# EasyEDA schematic Sketch.json
TITLE: PCB1; REV: 1.0; Date: 2024-06-23; Sheet: 1/1; Drawn By: techyporcupine; Company: techyporcupine
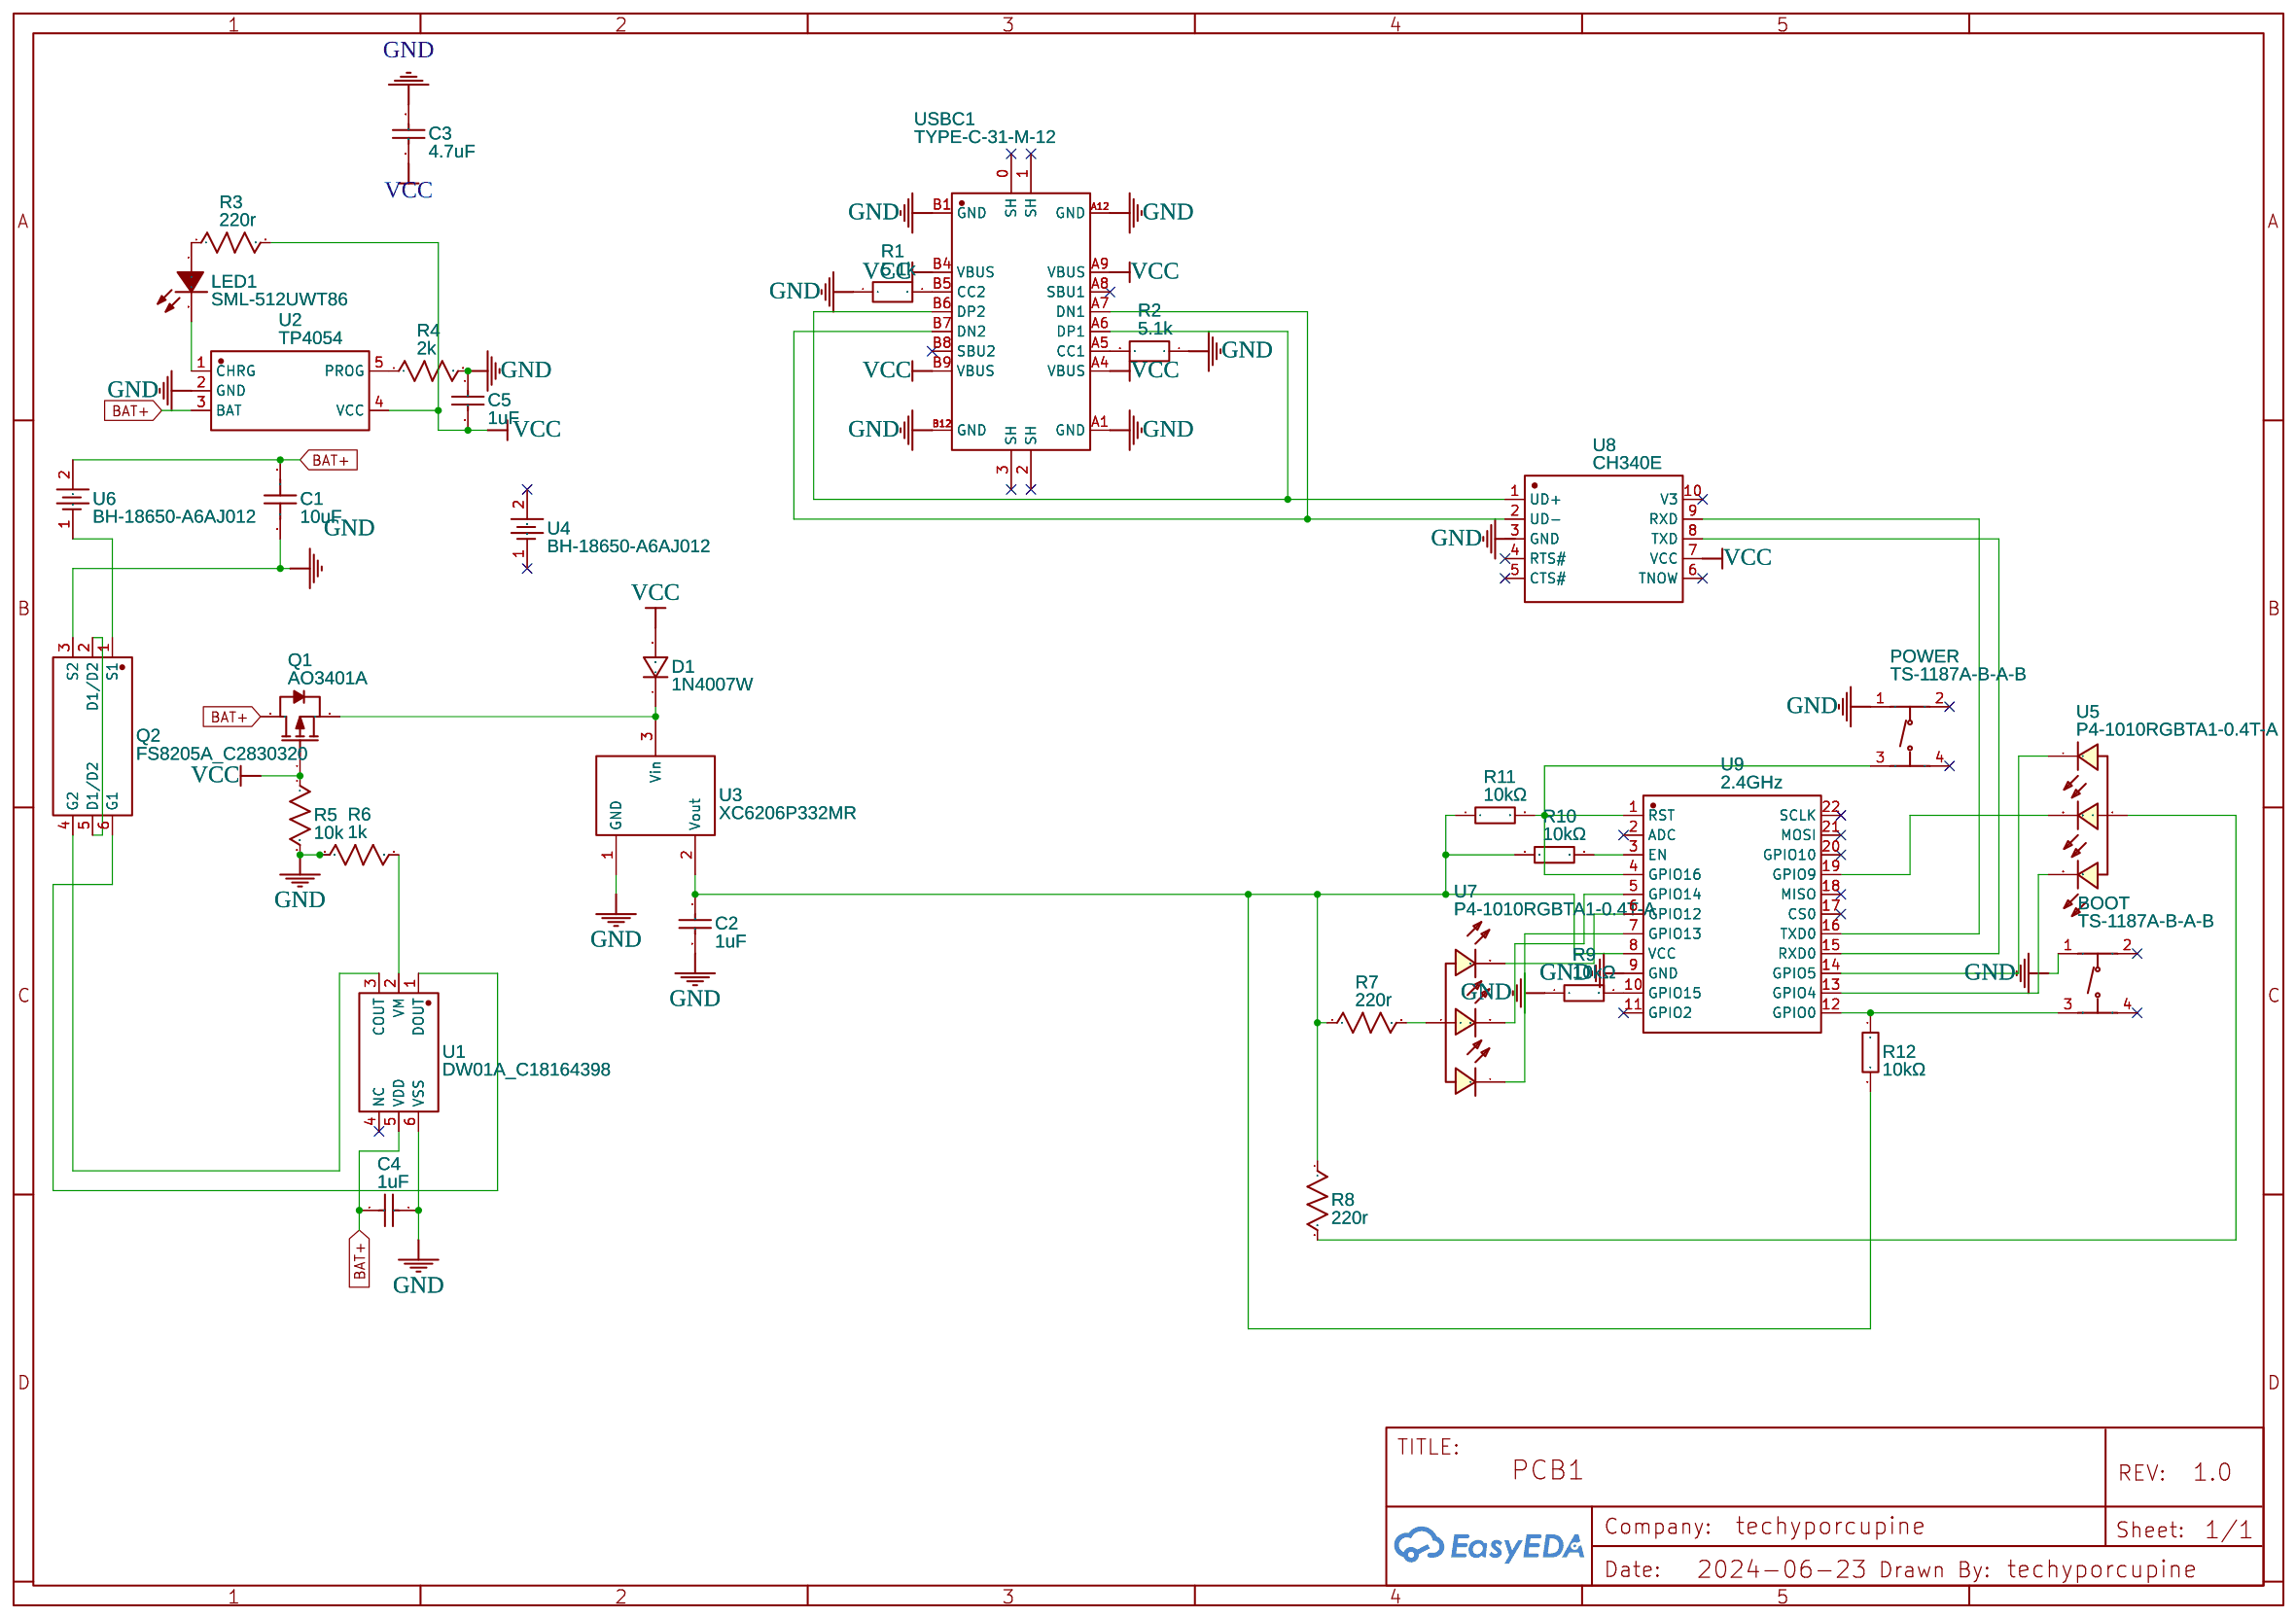
[diagram p0: schematic sheet]

## Parts
BOOT  TS-1187A-B-A-B  [SW-SMD_4P-L5.1-W5.1-P3.70-LS6.5-TL-2]
C1  10uF  [C0805]
C2  1uF  [C0805]
C3  4.7uF  [C0805]
C4  1uF  [C0805]
C5  1uF  [C0805]
D1  1N4007W  [SOD-123_L2.8-W1.8-LS3.7-RD]
LED1  SML-512UWT86  [LED0603-R-RD_RED]
POWER  TS-1187A-B-A-B  [SW-SMD_4P-L5.1-W5.1-P3.70-LS6.5-TL-2]
Q1  AO3401A  [SOT-23_L2.9-W1.3-P1.90-LS2.4-BR]
Q2  FS8205A_C2830320  [SOT-23-6_L2.9-W1.6-P0.95-LS2.8-BR]
R1  5.1k  [R0402]
R2  5.1k  [R0402]
R3  220r  [R0603]
R4  2k  [R0402]
R5  10k  [R0402]
R6  1k  [R0603]
R7  220r  [R0603]
R8  220r  [R0603]
R9  10kΩ  [R0603]
R10  10kΩ  [R0603]
R11  10kΩ  [R0603]
R12  10kΩ  [R0603]
U1  DW01A_C18164398  [SOT-23-6_L2.9-W1.6-P0.95-LS2.8-BR]
U2  TP4054  [SOT-23-5_L3.0-W1.7-P0.95-LS2.8-BL]
U3  XC6206P332MR  [SOT-23-3_L2.9-W1.6-P1.90-LS2.8-BR]
U4  BH-18650-A6AJ012  [BAT-TH_BH-18650-A6AJ012]
U5  P4-1010RGBTA1-0.4T-A  [LED-SMD_4P-L1.0-W1.0-P0.80-BR]
U6  BH-18650-A6AJ012  [BAT-TH_BH-18650-A6AJ012]
U7  P4-1010RGBTA1-0.4T-A  [LED-SMD_4P-L1.0-W1.0-P0.80-BR]
U8  CH340E  [MSOP-10_L3.0-W3.0-P0.50-LS5.0-BL]
U9  2.4GHz  [WIFIM-SMD_ESP-12F-ESP8266MOD]
USBC1  TYPE-C-31-M-12  [USB-C_SMD-TYPE-C-31-M-12]

## Library data of the parts
BOOT POWER = TS-1187A-B-A-B: Contributor: LCSC; Supplier: LCSC; Supplier Part: C318884; Manufacturer: XKB Connectivity(中国星坤); JLCPCB Part Class: Basic Part
C1 = GRT21BC71E106KE13L: Contributor: lcsc; Supplier: LCSC; Supplier Part: C882505; Manufacturer: muRata(村田); JLCPCB Part Class: Extended Part
C2 C4 C5 = 0805F105M500NT: Supplier: LCSC; Manufacturer: FH(风华); Supplier Part: C35795
C3 = CL21A475KAQNNNE: Supplier: LCSC; Manufacturer: SAMSUNG(三星); Supplier Part: C1779; JLCPCB Part Class: Basic Part
D1 = 1N4007W: Supplier: LCSC; Supplier Part: C328592; Manufacturer: BLUE ROCKET; Contributor: LCEDA_Lib
LED1 = SML-512UWT86: Contributor: lcsc; Supplier: LCSC; Supplier Part: C2922668; Manufacturer: ROHM(罗姆); Manufacturer Part: SML-D12M1WT86
Q1 = AO3401A: Supplier: LCSC; Manufacturer: AOS; Supplier Part: C15127; JLCPCB Part Class: Basic Part
Q2 = FS8205A_C2830320: Contributor: LCSC; Supplier: LCSC; Supplier Part: C2830320; Manufacturer: TECH PUBLIC(台舟); Manufacturer Part: FS8205A; JLCPCB Part Class: Extended Part
R1 R2 = R_0603_EU: Supplier Part: C102734; Supplier: LCSC; Contributor: LCEDA_Lib; Manufacturer Part: RTT015101FTH; Manufacturer: RALEC(旺诠)
R3 R7 R8 = R_0603_US: Supplier Part: C22962; Supplier: LCSC; Contributor: LCEDA_Lib; Manufacturer Part: 0603WAF2200T5E; Manufacturer: UNI-ROYAL(厚声)
R4 = R_0603_US: Supplier Part: C4109; Supplier: LCSC; Contributor: LCEDA_Lib; Manufacturer Part: 0402WGF2001TCE; Manufacturer: UNI-ROYAL(厚声)
R5 = R_0603_US: Supplier Part: C2902636; Supplier: LCSC; Contributor: LCEDA_Lib; Manufacturer Part: ARG02BTC1002; Manufacturer: Viking(光颉)
R6 = R_0603_US: Supplier Part: C17513; Supplier: LCSC; Contributor: LCEDA_Lib; Manufacturer Part: 0805W8F1001T5E; Manufacturer: UNI-ROYAL(厚声)
R9-R12 = 0603WAF1002T5E: Supplier: LCSC; Manufacturer: UNI-ROYAL(厚声); Supplier Part: C25804; JLCPCB Part Class: Basic Part
U1 = DW01A_C18164398: Supplier: LCSC; Supplier Part: C18164398; Manufacturer: HL(富海微); Manufacturer Part: DW01A; Contributor: lcsc; JLCPCB Part Class: Extended Part
U2 = TP4054: sourceId: dx642CAWU; Contributor: kyle.hu.gz; Supplier: LCSC; Manufacturer: TOPPOWER(南京拓微); Manufacturer Part: TP4054-42-SOT25R; Supplier Part: C32574; JLCPCB Part Class: Extended Part
U3 = XC6206P332MR: Supplier: LCSC; Manufacturer: TOREX(特瑞仕); Manufacturer Part: XC6206P332MR-G; Supplier Part: C5446; JLCPCB Part Class: Basic Part
U4 U6 = BH-18650-A6AJ012: Supplier: LCSC; Supplier Part: C19184084; Manufacturer: MYOUNG(美阳); JLCPCB Part Class: Extended Part; Contributor: lcsc
U5 U7 = P4-1010RGBTA1-0.4T-A: Contributor: lcsc; Supplier: LCSC; Supplier Part: C2827293; Manufacturer: TUOZHAN(拓展光电); JLCPCB Part Class: Extended Part
U8 = CH340E: Supplier: LCSC; Manufacturer: WCH(南京沁恒); Supplier Part: C99652; JLCPCB Part Class: Extended Part
U9 = ESP-12F(ESP8266MOD): Supplier: LCSC; Manufacturer: Ai-Thinker(安信可); Supplier Part: C82891; JLCPCB Part Class: Extended Part
USBC1 = TYPE-C-31-M-12: Contributor: LCSC; Supplier: LCSC; Supplier Part: C165948; Manufacturer: 韩国韩荣; JLCPCB Part Class: Extended Part

## Nets
GND: BOOT.1(A) C1.1 C2.2 C3.2 C4.1 C5.1 POWER.1(A) Q2.3(S2) R1.1 R2.1 R4.2 R5.2 R6.1 R9.1 U1.6(VSS) U2.2(GND) U3.1(GND) U8.3(GND) U9.9(GND) USBC1.A1(GND) USBC1.A12(GND) USBC1.B1(GND) USBC1.B12(GND)
VCC: C3.1 C5.2 D1.2 Q1.1(G) R3.2 R5.1 U2.4(VCC) U8.7(VCC) USBC1.A4(VBUS) USBC1.A9(VBUS) USBC1.B4(VBUS) USBC1.B9(VBUS)
BAT+: C1.2 C4.2 Q1.3(D) U1.5(VDD) U2.3(BAT) U6.2
Net-(BOOT-3): BOOT.3(C) R12.1 U9.12(GPIO0)
Net-(C2-1): C2.1 R7.1 R8.1 R10.1 R11.1 R12.2 U3.2(Vout) U9.8(VCC)
Net-(D1-1): D1.1 Q1.2(S) U3.3(Vin)
Net-(LED1-1): LED1.1(A) R3.1
Net-(LED1-2): LED1.2(K) U2.1(CHRG)
Net-(POWER-3): POWER.3(C) R11.2 U9.1(RST) U9.4(GPIO16)
Net-(Q2-1): Q2.1(S1) U6.1
Net-(Q2-2): Q2.2(D1/D2) Q2.5(D1/D2)
Net-(Q2-4): Q2.4(G2) U1.3(COUT)
Net-(Q2-6): Q2.6(G1) U1.1(DOUT)
Net-(R1-2): R1.2 USBC1.B5(CC2)
Net-(R2-2): R2.2 USBC1.A5(CC1)
Net-(R4-1): R4.1 U2.5(PROG)
Net-(R6-2): R6.2 U1.2(VM)
Net-(R7-2): R7.2 U7.1
Net-(R8-2): R8.2 U5.1
Net-(R9-2): R9.2 U9.10(GPIO15)
Net-(R10-2): R10.2 U9.3(EN)
Net-(U5-2): U5.2 U9.13(GPIO4)
Net-(U5-3): U5.3 U9.19(GPIO9)
Net-(U5-4): U5.4 U9.14(GPIO5)
Net-(U7-2): U7.2 U9.6(GPIO12)
Net-(U7-3): U7.3 U9.5(GPIO14)
Net-(U7-4): U7.4 U9.7(GPIO13)
Net-(U8-1): U8.1(UD+) USBC1.A6(DP1) USBC1.B6(DP2)
Net-(U8-2): U8.2(UD-) USBC1.A7(DN1) USBC1.B7(DN2)
Net-(U8-8): U8.8(TXD) U9.15(RXD0)
Net-(U8-9): U8.9(RXD) U9.16(TXD0)

Not connected (* = marked no-connect by the designer): BOOT 2(B)* 4(D)*; POWER 2(B)* 4(D)*; U1 4(NC)*; U4 1* 2*; U8 4(RTS#)* 5(CTS#)* 6(TNOW)* 10(V3)*; U9 2(ADC)* 11(GPIO2)* 17(CS0)* 18(MISO)* 20(GPIO10)* 21(MOSI)* 22(SCLK)*; USBC1 0(SH)* 1(SH)* 2(SH)* 3(SH)* A8(SBU1)* B8(SBU2)*
